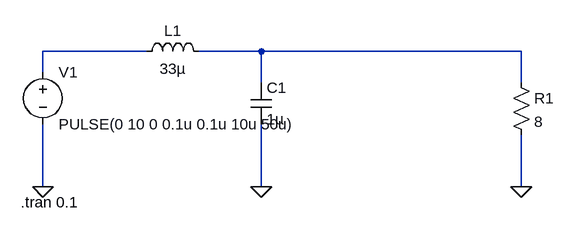
[diagram p0: schematic PulseToSinus.asc]
PulseToSinus.asc, the LTspice schematic file:
Version 4
SHEET 1 880 680
WIRE -128 96 -288 96
WIRE 48 96 -48 96
WIRE 448 96 48 96
WIRE -288 128 -288 96
WIRE 48 144 48 96
WIRE 448 144 448 96
WIRE -288 304 -288 208
WIRE 48 304 48 208
WIRE 448 304 448 224
FLAG -288 304 0
FLAG 48 304 0
FLAG 448 304 0
SYMBOL voltage -288 112 R0
WINDOW 123 0 0 Left 2
WINDOW 39 0 0 Left 2
SYMATTR InstName V1
SYMATTR Value PULSE(0 10 0 0.1u 0.1u 10u 50u)
SYMBOL ind -144 112 R270
WINDOW 0 32 56 VTop 2
WINDOW 3 5 56 VBottom 2
SYMATTR InstName L1
SYMATTR Value 33µ
SYMBOL cap 32 144 R0
SYMATTR InstName C1
SYMATTR Value 1µ
SYMATTR SpiceLine V=50 Irms=3.96 Rser=0.0234673 Lser=0 mfg="KEMET" pn="C1825C105K5RAC" type="X7R"
SYMBOL res 432 128 R0
SYMATTR InstName R1
SYMATTR Value 8
SYMATTR SpiceLine tol=1 pwr=0.1
TEXT -322 328 Left 2 !.tran 0.1

The netlist it stands for:
* PulseToSinus.asc
V1 N001 0 PULSE(0 10 0 0.1u 0.1u 10u 50u)
L1 N001 N002 33µ
C1 N002 0 1µ V=50 Irms=3.96 Rser=0.0234673 Lser=0 mfg="KEMET" pn="C1825C105K5RAC" type="X7R"
R1 N002 0 8 tol=1 pwr=0.1
.tran 0.1
.backanno
.end